# Altium schematic sheet config.SchDoc: Triumvi - Configuration
size Letter; Author: Ye-Sheng Kuo; Revision: 12; SheetNumber: 1; SheetTotal: 1
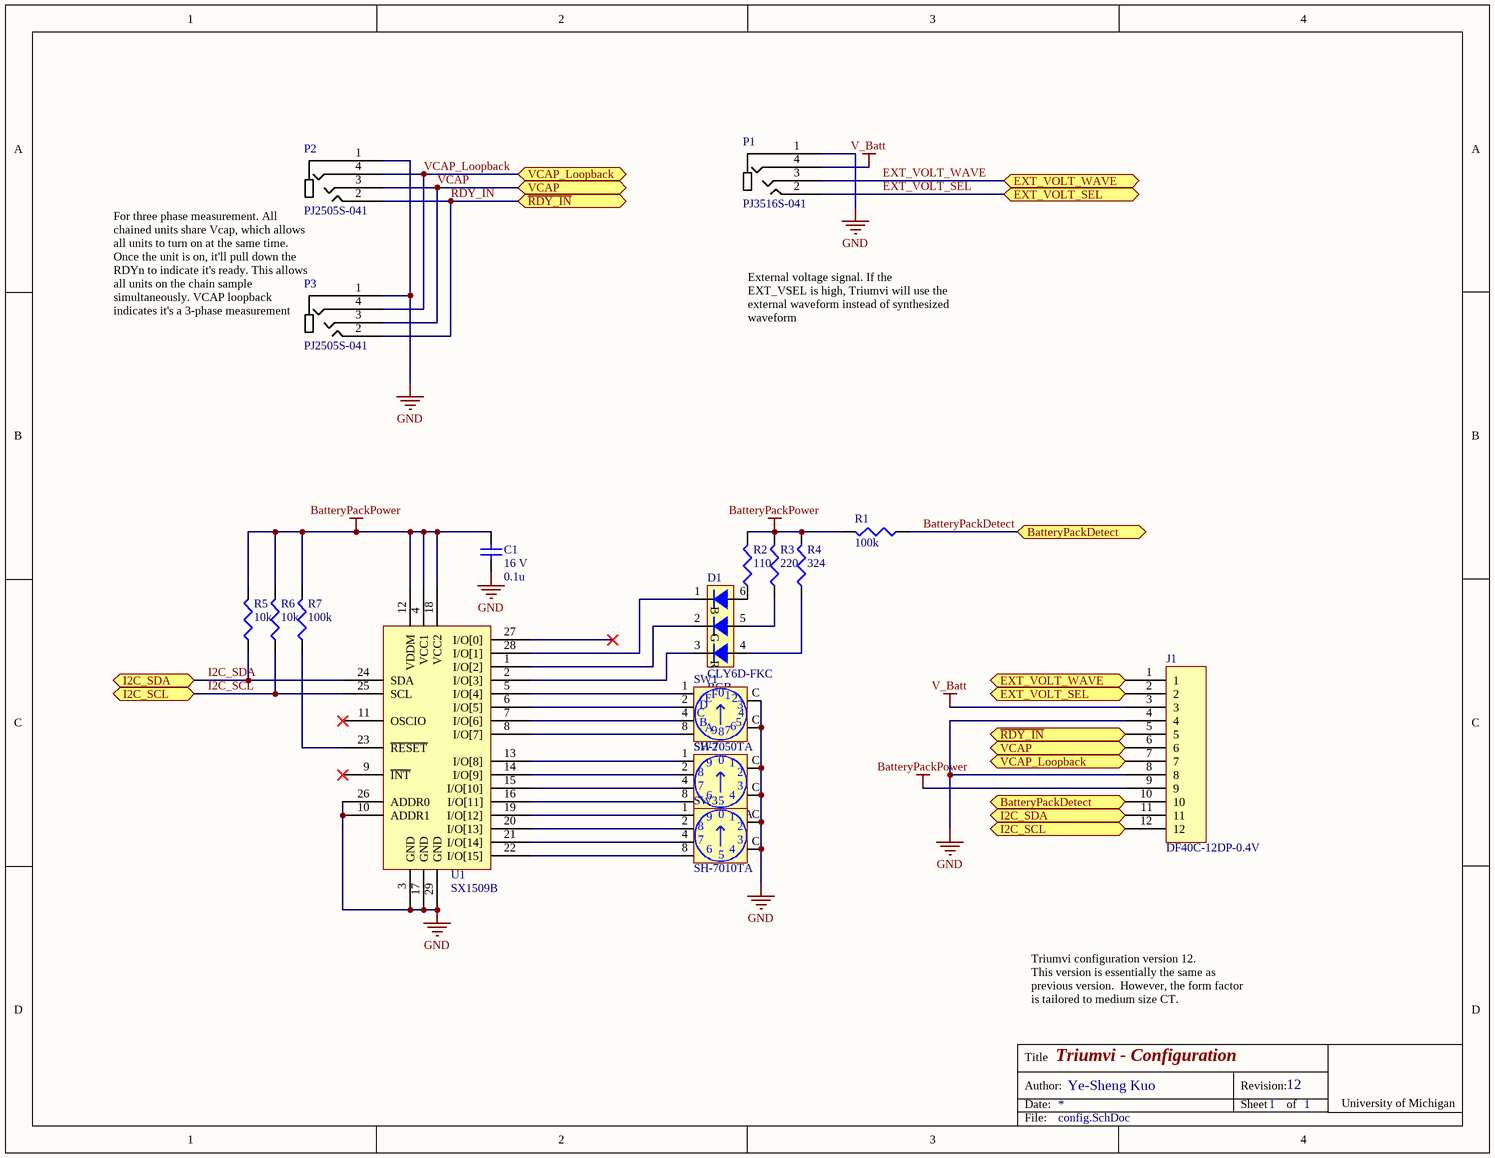
[diagram p0: config.SchDoc]

## Parts
C1  voltage rated: 16 V  [0402]  (hidden comment: 0.1u)
D1  CLY6D-FKC  value RGB  [PLCC6]
J1  DF40C-12DP-0.4V  [DF40C-12DP-0.4V]
P1  PJ3516S-041  [PJ3516S-041]
P2  PJ2505S-041  [PJ2505S-041]
P3  PJ2505S-041  [PJ2505S-041]
R1  100k  [0402]
R2  110  [0402]
R3  220  [0402]
R4  324  [0402]
R5  10k  [0402]
R6  10k  [0402]
R7  100k  [0402]
SW1  SH-7050TA  [SH-7050A]
SW2  SH-7010TA  [SH-7010A]
SW3  SH-7010TA  [SH-7010A]
U1  SX1509B  [QFN40P400X400X60_HS-29N]

## Ports
BatteryPackDetect, EXT_VOLT_SEL, EXT_VOLT_WAVE, I2C_SCL, I2C_SDA, VCAP, VCAP_Loopback, ~{RDY_IN}

## Nets
BatteryPackPower: C1.1 J1.9 R1.1 R2.1 R3.1 R4.1 R5.1 R6.1 R7.1 U1.4(VCC1) U1.12(VDDM) U1.18(VCC2)
GND: C1.2 J1.4 J1.8 P1.1 P2.1 P3.1 SW1.C SW2.C SW3.C U1.3(GND) U1.10(ADDR1) U1.17(GND) U1.26(ADDR0) U1.29(GND)
V_Batt: J1.3 P1.4
BatteryPackDetect: J1.10 R1.2 ; port BatteryPackDetect
EXT_VOLT_SEL: J1.2 P1.2 ; port EXT_VOLT_SEL
EXT_VOLT_WAVE: J1.1 P1.3 ; port EXT_VOLT_WAVE
I2C_SCL: J1.12 R6.2 U1.25(SCL) ; port I2C_SCL
I2C_SDA: J1.11 R5.2 U1.24(SDA) ; port I2C_SDA
~{RDY_IN}: J1.5 P2.2 P3.2 ; port ~{RDY_IN}
VCAP: J1.6 P2.3 P3.3 ; port VCAP
VCAP_Loopback: J1.7 P2.4 P3.4 ; port VCAP_Loopback
NetD1_1: D1.1 U1.28(I/O[1])
NetD1_2: D1.2 U1.1(I/O[2])
NetD1_3: D1.3 U1.2(I/O[3])
NetD1_4: D1.4 R4.2
NetD1_5: D1.5 R3.2
NetD1_6: D1.6 R2.2
NetR7_2: R7.2 U1.23(~{RESET})
NetSW1_1: SW1.1 U1.5(I/O[4])
NetSW1_2: SW1.2 U1.6(I/O[5])
NetSW1_4: SW1.4 U1.7(I/O[6])
NetSW1_8: SW1.8 U1.8(I/O[7])
NetSW2_1: SW2.1 U1.13(I/O[8])
NetSW2_2: SW2.2 U1.14(I/O[9])
NetSW2_4: SW2.4 U1.15(I/O[10])
NetSW2_8: SW2.8 U1.16(I/O[11])
NetSW3_1: SW3.1 U1.19(I/O[12])
NetSW3_2: SW3.2 U1.20(I/O[13])
NetSW3_4: SW3.4 U1.21(I/O[14])
NetSW3_8: SW3.8 U1.22(I/O[15])

Not connected (* = marked no-connect by the designer): U1 9(~{INT})* 11(OSCIO)* 27(I/O[0])*

## Notes on the sheet
- For three phase measurement. All chained units share Vcap, which allows all units to turn on at the same time. Once the unit is on, it'll pull down the RDYn to indicate it's ready. This allows all units on the chain sample simultaneously. VCAP loopback indicates it's a 3-phase measurement
- External voltage signal. If the EXT_VSEL is high, Triumvi will use the external waveform instead of synthesized waveform
- Triumvi configuration version 12.
  This version is essentially the same as previous version.  However, the form factor is tailored to medium size CT.
- Title
- Date:
- Author:
- Revision:
- Sheet
- of
- University of Michigan
- File:
- (in symbol CLY6D-FKC-CK1N1D1BB7D3D3) B; G; R
- (in symbol SH-7010TA) 9; 0; 7; 3; 6; 5
- (in symbol SH-7050TA) F; 0; E; D; 3; B; 5; A; 6; 9; 7

## Library data of the parts
C1 = GRM155R71C104KA88D: 0.10µF ±10% 16V Ceramic Capacitor X7R 0402; Manufacture: Murata; tolerance: 10%; package: 0402; Supplier 1: Digi-Key; Supplier Part Number 1: 490-3261-1-ND; Value: 0.1u; Temperature Coefficient: X7R; Manufacturer Part Number: GRM155R71C104KA88D
D1 = CLY6D-FKC-CK1N1D1BB7D3D3: Red, Green, Blue (RGB) 622nm Red, 530nm Green, 470nm Blue LED Indication - Discrete 2.1V Red, 3V Green, 3V Blue 6-SMD, J-Lead; Manufacturer: CREE Inc; Supplier 1: Digi-Key; Supplier Part Number 1: CLY6D-FKC-CK1N1D1BB7D3D3CT-ND; Manufacturer Part Number: CLY6D-FKC-CK1N1D1BB7D3D3; Wavelength: 622nm Red, 530nm Green, 470nm Blue
J1 = DF40C-12DP-0.4V: Hirose BM20 Series, 0.4mm pitch, 12 pos, header; Supplier 1: Digi-Key; Supplier Part Number 1: H124599CT-ND
P1 = PJ3516S-041: 3.5 mm phone jack, 4 terminals
P2 P3 = PJ2505S-041: 2.5 mm phone jack, 4 terminals
R1 R7 = CRCW0402100KFKED: RES SMD 100K OHM 1% 1/16W 0402; Manufacturer: Vishay Dale; Temperature Coefficient: 100 ppm/C; Tolerance: 1%; Power: 1/16 W; package: 0402; Supplier 1: Digi-Key; Supplier Part Number 1: 541-100KLCT-ND; value: 100k; Manufacturer Part Number: CRCW0402100KFKED
R2 = CRCW0402110RFKED: RES SMD 110 OHM 1% 1/16W 0402; Manufacturer: Vishay Dale; Temperature Coefficient: 100 ppm/C; Tolerance: 1%; Power: 1/16 W; package: 0402; Supplier 1: Digi-Key; Supplier Part Number 1: 541-110LCT-ND; value: 110; Manufacturer Part Number: CRCW0402110RFKED
R3 = CRCW0402220RFKED: RES SMD 220 OHM 1% 1/16W 0402; Manufacturer: Vishay Dale; Power: 1/5 W; Temperature Coefficient: 100 ppm; Tolerance: 1%; package: 0402; Supplier 1: Digi-Key; Supplier Part Number 1: 541-220LCT-ND; value: 220; Manufacturer Part Number: CRCW0402220RFKED
R4 = CRCW0402324RFKED: RES SMD 324 OHM 1% 1/16W 0402; Manufacturer: Vishay Dale; Temperature Coefficient: 100 ppm/C; Tolerance: 1%; Power: 1/16 W; package: 0402; Supplier 1: Digi-Key; Supplier Part Number 1: 541-324LCT-ND; value: 324; Manufacturer Part Number: CRCW0402324RFKED
R5 R6 = CRCW040210K0FKED: RES SMD 10K OHM 1% 1/16W 0402; Manufacturer: Vishay Dale; Temperature Coefficient: 100 ppm/C; Tolerance: 1%; Power: 1/16 W; package: 0402; Supplier 1: Digi-Key; Supplier Part Number 1: 541-10.0KLCT-ND; value: 10k; Manufacturer Part Number: CRCW040210K0FKED
SW1 = SH-7050TA: ROTARY CODED SWITCHES; Supplier 1: Digi-Key; Supplier Part Number 1: 563-1213-1-ND
SW2 SW3 = SH-7010TA: ROTARY CODED SWITCHES; Supplier 1: Digi-Key; Supplier Part Number 1: 563-1207-1-ND
U1 = SX1509B: Voltage Level Shifting GPIO  with LED Driver and Keypad Engine; Supplier 1: Digi-Key; Supplier Part Number 1: SX1509BIULCT-ND